# Altium project GamePi.PrjPcb
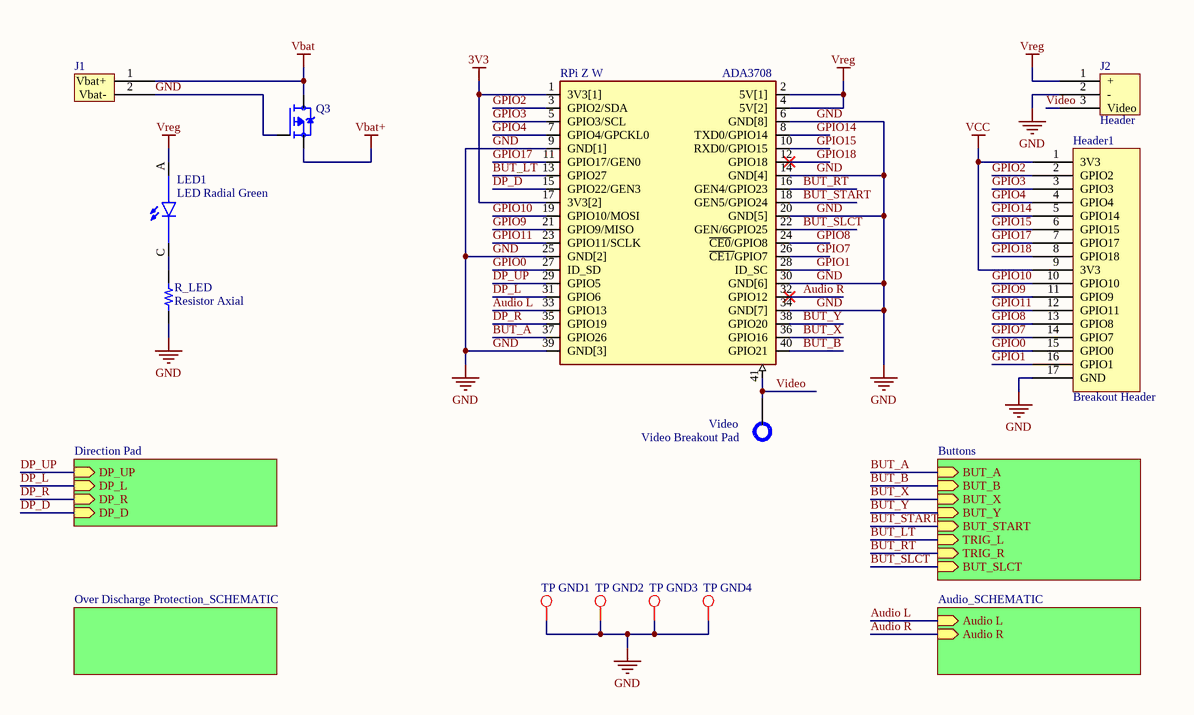
[diagram p0: GamePi_SCHEMATIC.SchDoc]
5 sheets, 92 parts. Net scope: hierarchical (ports join the sheet entries above them; power ports are global).
Board file: GamePi_PCB.PcbDoc
Sheets:
  GamePi_SCHEMATIC.SchDoc
    Direction Pad = Direction Pad_SCHEMATIC.SchDoc
    Buttons = Buttons_SCHEMATIC.SchDoc
    Over Discharge Protection_SCHEMATIC = Over Discharge Protection_SCHEMATIC.SchDoc
    Audio_SCHEMATIC = Audio_SCHEMATIC.SchDoc

## Sheet GamePi_SCHEMATIC.SchDoc
size A4; SheetNumber: 1; SheetTotal: 5

### Parts
Header1  Breakout Header  [Breakout Header]
J1  J?  [PS Header]  (value not drawn)
J2  Header  [Video Header]
LED1  LED Radial Green  [LED Radial Green]
Q3  NP15P04SLG  [NP15P04SLG]  (value not drawn)
R_LED  Resistor Axial  [Resistor Axial]
RPi_Z_W  ADA3708  [ADA3708_RPI-ZERO]
TP_GND1  Test Point  [Test Point]  (value not drawn)
TP_GND2  Test Point  [Test Point]  (value not drawn)
TP_GND3  Test Point  [Test Point]  (value not drawn)
TP_GND4  Test Point  [Test Point]  (value not drawn)
Video  Video Breakout Pad  [Video Breakout Pad]

### Sub-sheets
Audio_SCHEMATIC = Audio_SCHEMATIC.SchDoc: Audio L (in), Audio R (in)
Buttons = Buttons_SCHEMATIC.SchDoc: BUT_A (in), BUT_B (in), BUT_X (in), BUT_Y (in), BUT_START (in), TRIG_L (in), TRIG_R (in), BUT_SLCT (in)
Direction Pad = Direction Pad_SCHEMATIC.SchDoc: DP_UP (in), DP_L (in), DP_R (in), DP_D (in)
Over Discharge Protection_SCHEMATIC = Over Discharge Protection_SCHEMATIC.SchDoc: no entries

### Nets
3V3: RPi_Z_W.1(3V3[1]) RPi_Z_W.17(3V3[2])
GND: Header1.17(GND) J1.2(Vbat-) J2.2(-) Q3.1(G) R_LED.1 RPi_Z_W.6(GND[8]) RPi_Z_W.9(GND[1]) RPi_Z_W.14(GND[4]) RPi_Z_W.20(GND[5]) RPi_Z_W.25(GND[2]) RPi_Z_W.30(GND[6]) RPi_Z_W.34(GND[7]) RPi_Z_W.39(GND[3]) TP_GND1.TP?(Test_Point) TP_GND2.TP?(Test_Point) TP_GND3.TP?(Test_Point) TP_GND4.TP?(Test_Point)
Vbat: J1.1(Vbat+) Q3.4(D)
Vbat+: Q3.3(S)
VCC: Header1.1(3V3) Header1.9(3V3)
Vreg: J2.1(+) LED1.A RPi_Z_W.2(5V[1]) RPi_Z_W.4(5V[2])
Audio L: RPi_Z_W.33(GPIO13) ; sheet Audio_SCHEMATIC/Audio L
Audio R: RPi_Z_W.32(GPIO12) ; sheet Audio_SCHEMATIC/Audio R
BUT_A: RPi_Z_W.37(GPIO26) ; sheet Buttons/BUT_A
BUT_B: RPi_Z_W.40(GPIO21) ; sheet Buttons/BUT_B
BUT_LT: RPi_Z_W.13(GPIO27) ; sheet Buttons/TRIG_L
BUT_RT: RPi_Z_W.16(GEN4/GPIO23) ; sheet Buttons/TRIG_R
BUT_SLCT: RPi_Z_W.22(GEN/6GPIO25) ; sheet Buttons/BUT_SLCT
BUT_START: RPi_Z_W.18(GEN5/GPIO24) ; sheet Buttons/BUT_START
BUT_X: RPi_Z_W.36(GPIO16) ; sheet Buttons/BUT_X
BUT_Y: RPi_Z_W.38(GPIO20) ; sheet Buttons/BUT_Y
DP_D: RPi_Z_W.15(GPIO22/GEN3) ; sheet Direction Pad/DP_D
DP_L: RPi_Z_W.31(GPIO6) ; sheet Direction Pad/DP_L
DP_R: RPi_Z_W.35(GPIO19) ; sheet Direction Pad/DP_R
DP_UP: RPi_Z_W.29(GPIO5) ; sheet Direction Pad/DP_UP
GPIO0: Header1.15(GPIO0) RPi_Z_W.27(ID_SD)
GPIO1: Header1.16(GPIO1) RPi_Z_W.28(ID_SC)
GPIO2: Header1.2(GPIO2) RPi_Z_W.3(GPIO2/SDA)
GPIO3: Header1.3(GPIO3) RPi_Z_W.5(GPIO3/SCL)
GPIO4: Header1.4(GPIO4) RPi_Z_W.7(GPIO4/GPCKL0)
GPIO7: Header1.14(GPIO7) RPi_Z_W.26(~{CE1/}GPIO7)
GPIO8: Header1.13(GPIO8) RPi_Z_W.24(~{CE0}/GPIO8)
GPIO9: Header1.11(GPIO9) RPi_Z_W.21(GPIO9/MISO)
GPIO10: Header1.10(GPIO10) RPi_Z_W.19(GPIO10/MOSI)
GPIO11: Header1.12(GPIO11) RPi_Z_W.23(GPIO11/SCLK)
GPIO14: Header1.5(GPIO14) RPi_Z_W.8(TXD0/GPIO14)
GPIO15: Header1.6(GPIO15) RPi_Z_W.10(RXD0/GPIO15)
GPIO17: Header1.7(GPIO17) RPi_Z_W.11(GPIO17/GEN0)
GPIO18: Header1.8(GPIO18) RPi_Z_W.12(GPIO18)
Video: J2.3(Video) RPi_Z_W.41 Video.1
NetLED1_C: LED1.C R_LED.2

### Library data of the parts
J1 = PS Header
J2 = Video Header
RPi_Z_W = ADA3708: Raspberry Pi Zero WH (Zero W with Headers); MP: ADA3708; Availability: Unavailable; Package: None; Value: *; Price: None

## Sheet Direction Pad_SCHEMATIC.SchDoc
size A4; SheetNumber: 3; SheetTotal: 5
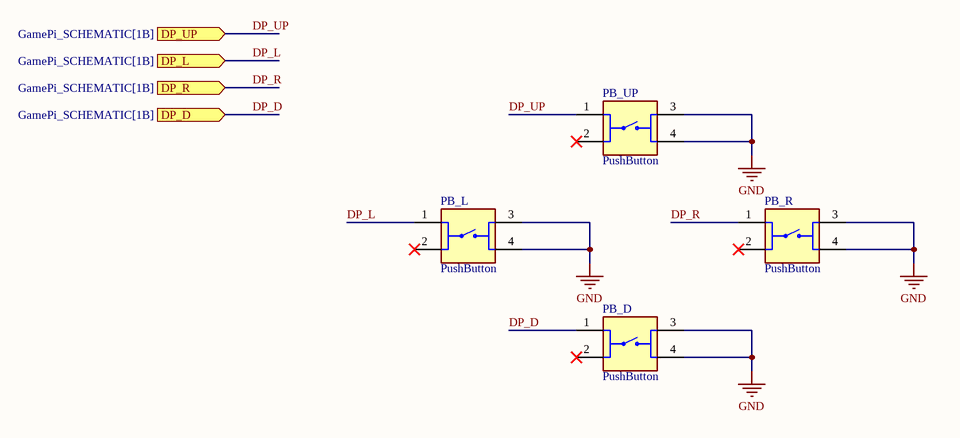
[diagram p1: Direction Pad_SCHEMATIC.SchDoc]

### Parts
PB_D  PushButton  [Push Button]
PB_L  PushButton  [Push Button]
PB_R  PushButton  [Push Button]
PB_UP  PushButton  [Push Button]

### Ports
DP_D (in, see GamePi_SCHEMATIC[1B]), DP_L (in, see GamePi_SCHEMATIC[1B]), DP_R (in, see GamePi_SCHEMATIC[1B]), DP_UP (in, see GamePi_SCHEMATIC[1B])

### Nets
GND: PB_D.3 PB_D.4 PB_L.3 PB_L.4 PB_R.3 PB_R.4 PB_UP.3 PB_UP.4
DP_D: PB_D.1 ; port DP_D
DP_L: PB_L.1 ; port DP_L
DP_R: PB_R.1 ; port DP_R
DP_UP: PB_UP.1 ; port DP_UP

Not connected (* = marked no-connect by the designer): PB_D 2*; PB_L 2*; PB_R 2*; PB_UP 2*

## Sheet Buttons_SCHEMATIC.SchDoc
size A4; SheetNumber: 4; SheetTotal: 5
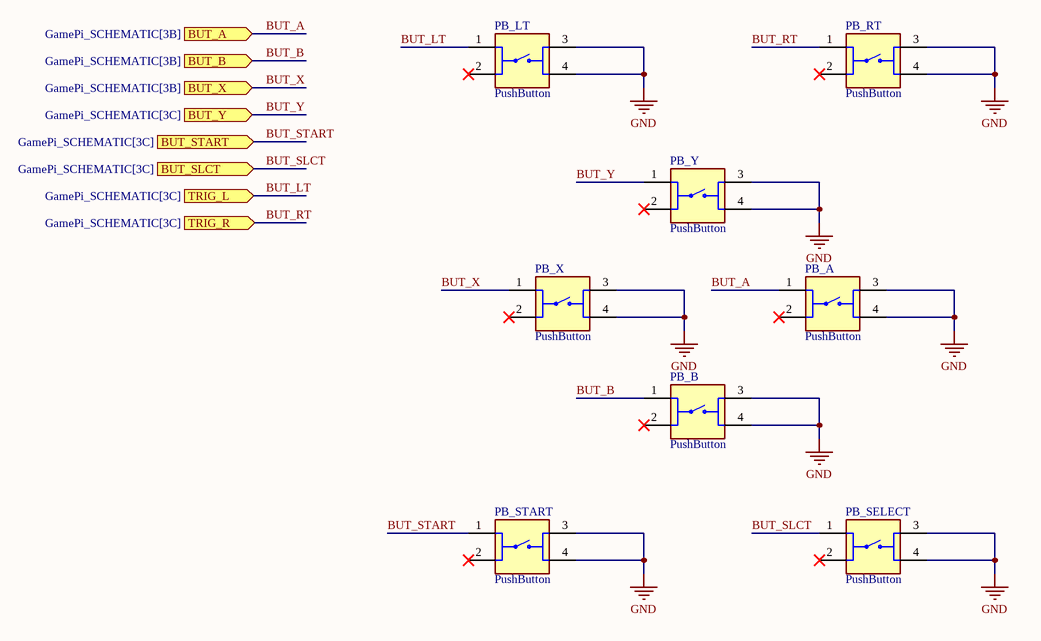
[diagram p2: Buttons_SCHEMATIC.SchDoc]

### Parts
PB_A  PushButton  [Push Button]
PB_B  PushButton  [Push Button]
PB_LT  PushButton  [Push Button]
PB_RT  PushButton  [Push Button]
PB_SELECT  PushButton  [Push Button]
PB_START  PushButton  [Push Button]
PB_X  PushButton  [Push Button]
PB_Y  PushButton  [Push Button]

### Ports
BUT_A (in, see GamePi_SCHEMATIC[3B]), BUT_B (in, see GamePi_SCHEMATIC[3B]), BUT_SLCT (in, see GamePi_SCHEMATIC[3C]), BUT_START (in, see GamePi_SCHEMATIC[3C]), BUT_X (in, see GamePi_SCHEMATIC[3B]), BUT_Y (in, see GamePi_SCHEMATIC[3C]), TRIG_L (in, see GamePi_SCHEMATIC[3C]), TRIG_R (in, see GamePi_SCHEMATIC[3C])

### Nets
GND: PB_A.3 PB_A.4 PB_B.3 PB_B.4 PB_LT.3 PB_LT.4 PB_RT.3 PB_RT.4 PB_SELECT.3 PB_SELECT.4 PB_START.3 PB_START.4 PB_X.3 PB_X.4 PB_Y.3 PB_Y.4
BUT_A: PB_A.1 ; port BUT_A
BUT_B: PB_B.1 ; port BUT_B
BUT_LT: PB_LT.1 ; port TRIG_L
BUT_RT: PB_RT.1 ; port TRIG_R
BUT_SLCT: PB_SELECT.1 ; port BUT_SLCT
BUT_START: PB_START.1 ; port BUT_START
BUT_X: PB_X.1 ; port BUT_X
BUT_Y: PB_Y.1 ; port BUT_Y

Not connected (* = marked no-connect by the designer): PB_A 2*; PB_B 2*; PB_LT 2*; PB_RT 2*; PB_SELECT 2*; PB_START 2*; PB_X 2*; PB_Y 2*

## Sheet Over Discharge Protection_SCHEMATIC.SchDoc
size A4; SheetNumber: 2; SheetTotal: 5
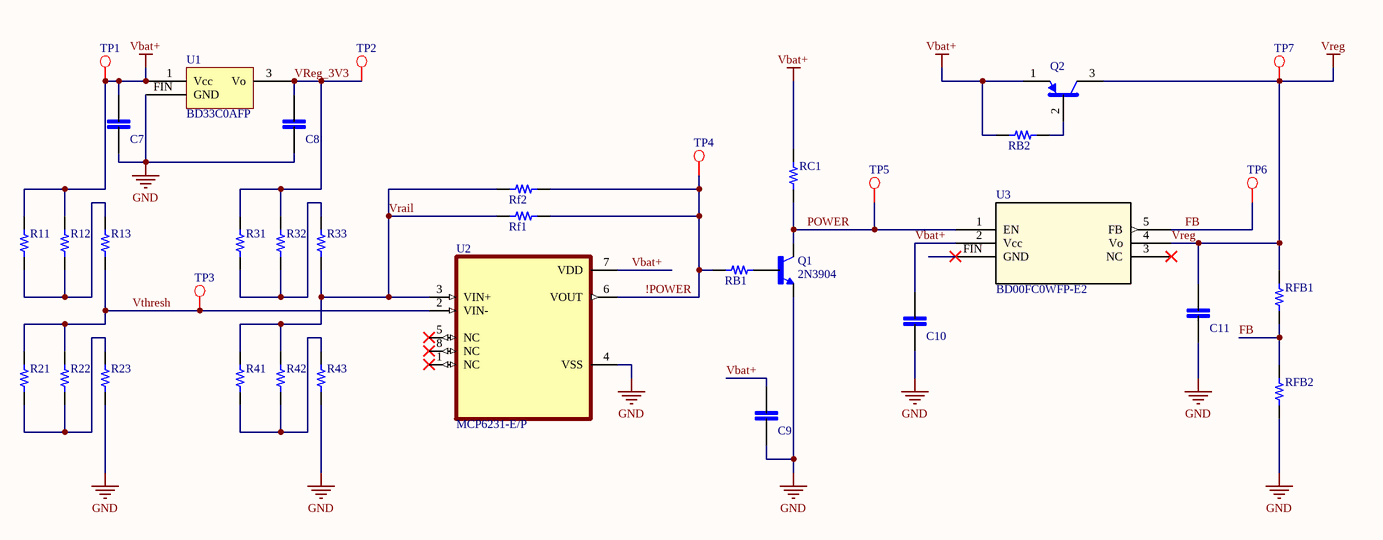
[diagram p3: Over Discharge Protection_SCHEMATIC.SchDoc]

### Parts
C7  0805  [Capacitor 0805]  (value not drawn)
C8  0805  [Capacitor 0805]  (value not drawn)
C9  0805  [Capacitor 0805]  (value not drawn)
C10  0805  [Capacitor 0805]  (value not drawn)
C11  0805  [Capacitor 0805]  (value not drawn)
Q1  2N3904  [2N3904]
Q2  2N3906  [2N3904]  (value not drawn)
R11  Resistor Axial  [Resistor Axial]  (value not drawn)
R12  Resistor Axial  [Resistor Axial]  (value not drawn)
R13  Resistor Axial  [Resistor Axial]  (value not drawn)
R21  Resistor Axial  [Resistor Axial]  (value not drawn)
R22  Resistor Axial  [Resistor Axial]  (value not drawn)
R23  Resistor Axial  [Resistor Axial]  (value not drawn)
R31  Resistor Axial  [Resistor Axial]  (value not drawn)
R32  Resistor Axial  [Resistor Axial]  (value not drawn)
R33  Resistor Axial  [Resistor Axial]  (value not drawn)
R41  Resistor Axial  [Resistor Axial]  (value not drawn)
R42  Resistor Axial  [Resistor Axial]  (value not drawn)
R43  Resistor Axial  [Resistor Axial]  (value not drawn)
RB1  Resistor Axial  [Resistor Axial]  (value not drawn)
RB2  Resistor Axial  [Resistor Axial]  (value not drawn)
RC1  Resistor Axial  [Resistor Axial]  (value not drawn)
Rf1  Resistor Axial  [Resistor Axial]  (value not drawn)
Rf2  Resistor Axial  [Resistor Axial]  (value not drawn)
RFB1  Resistor Axial  [Resistor Axial]  (value not drawn)
RFB2  Resistor Axial  [Resistor Axial]  (value not drawn)
TP1  Test Point  [Test Point]  (value not drawn)
TP2  Test Point  [Test Point]  (value not drawn)
TP3  Test Point  [Test Point]  (value not drawn)
TP4  Test Point  [Test Point]  (value not drawn)
TP5  Test Point  [Test Point]  (value not drawn)
TP6  Test Point  [Test Point]  (value not drawn)
TP7  Test Point  [Test Point]  (value not drawn)
U1  BD33C0AFP  [BD33C0AFP]
U2  MCP6231-E/P  [MCP6231-E/P]
U3  BD00FC0WFP-E2  [BD00FC0WFP-E2]

### Nets
GND: C7.1 C8.1 C9.1 C10.1 C11.1 Q1.1(E) R23.1 R43.1 RFB2.1 U1.FIN(GND) U2.4(VSS)
Vbat+: C7.2 C9.2 C10.2 Q2.1(E) R11.2 R12.2 RB2.2 RC1.2 TP1.TP?(Test_Point) U1.1(Vcc) U2.7(VDD) U3.2(Vcc)
Vreg: C11.2 Q2.3(C) RFB1.2 TP7.TP?(Test_Point) U3.4(Vo)
!POWER: RB1.2 Rf1.1 Rf2.1 TP4.TP?(Test_Point) U2.6(VOUT)
FB: RFB1.1 RFB2.2 TP6.TP?(Test_Point) U3.5(FB)
POWER: Q1.3(C) RC1.1 TP5.TP?(Test_Point) U3.1(EN)
Vrail: R33.1 R41.2 R42.2 Rf1.2 Rf2.2 U2.3(VIN+)
VReg_3V3: C8.2 R31.2 R32.2 TP2.TP?(Test_Point) U1.3(Vo)
Vthresh: R13.1 R21.2 R22.2 TP3.TP?(Test_Point) U2.2(VIN-)
NetQ1_2: Q1.2(B) RB1.1
NetQ2_2: Q2.2(B) RB2.1
NetR11_1: R11.1 R12.1 R13.2
NetR21_1: R21.1 R22.1 R23.2
NetR31_1: R31.1 R32.1 R33.2
NetR41_1: R41.1 R42.1 R43.2

Not connected (* = marked no-connect by the designer): U2 1(NC)* 5(NC)* 8(NC)*; U3 3(NC)* FIN(GND)*

### Library data of the parts
C7-C11 = Capacitor 0805

## Sheet Audio_SCHEMATIC.SchDoc
size A4; SheetNumber: 5; SheetTotal: 5
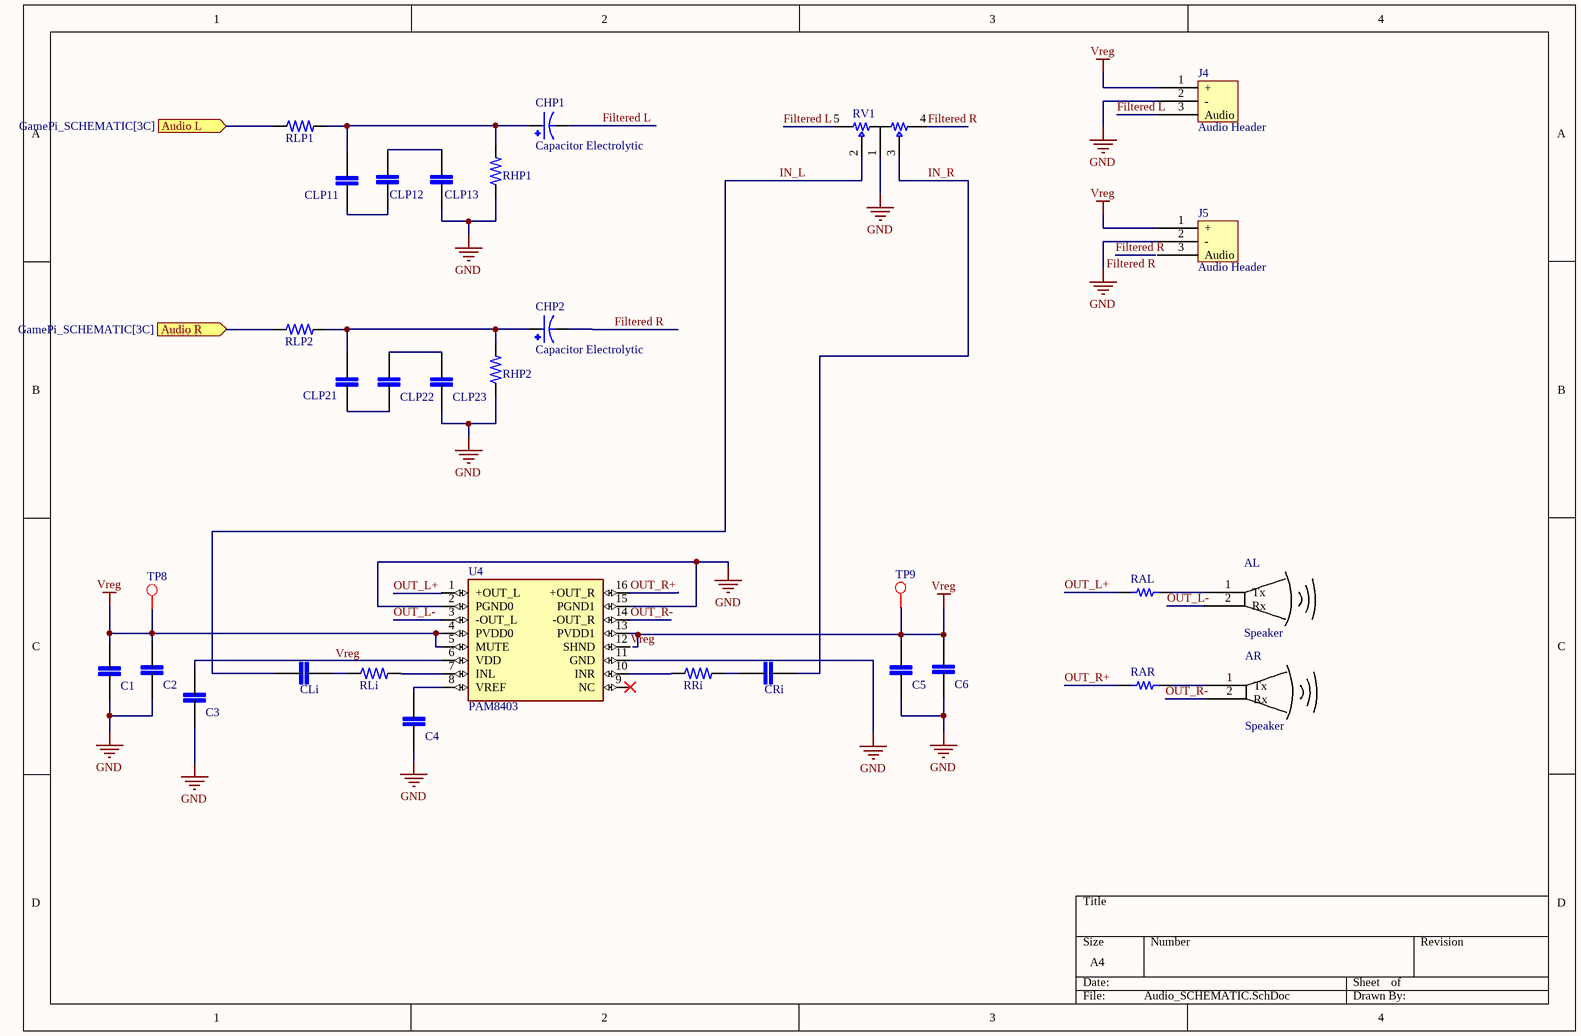
[diagram p4: Audio_SCHEMATIC.SchDoc]

### Parts
AL  Speaker  [Speaker]
AR  Speaker  [Speaker]
C1  0805  [Capacitor 0805]  (value not drawn)
C2  0805  [Capacitor 0805]  (value not drawn)
C3  0805  [Capacitor 0805]  (value not drawn)
C4  0805  [Capacitor 0805]  (value not drawn)
C5  0805  [Capacitor 0805]  (value not drawn)
C6  0805  [Capacitor 0805]  (value not drawn)
CHP1  Capacitor Electrolytic  [Capacitor Electrolytic]
CHP2  Capacitor Electrolytic  [Capacitor Electrolytic]
CLi  0805  [Capacitor 0805]  (value not drawn)
CLP11  0805  [Capacitor 0805]  (value not drawn)
CLP12  0805  [Capacitor 0805]  (value not drawn)
CLP13  0805  [Capacitor 0805]  (value not drawn)
CLP21  0805  [Capacitor 0805]  (value not drawn)
CLP22  0805  [Capacitor 0805]  (value not drawn)
CLP23  0805  [Capacitor 0805]  (value not drawn)
CRi  0805  [Capacitor 0805]  (value not drawn)
J4  Audio Header  [Audio Header]
J5  Audio Header  [Audio Header]
RAL  Resistor Axial  [Resistor Axial]  (value not drawn)
RAR  Resistor Axial  [Resistor Axial]  (value not drawn)
RHP1  0805  [Resistor 0805]  (value not drawn)
RHP2  0805  [Resistor 0805]  (value not drawn)
RLi  0805  [Resistor 0805]  (value not drawn)
RLP1  0805  [Resistor 0805]  (value not drawn)
RLP2  0805  [Resistor 0805]  (value not drawn)
RRi  0805  [Resistor 0805]  (value not drawn)
RV1  B103 Potentiometer Wheel  [B103 Pot Wheel]  (value not drawn)
TP8  Test Point  [Test Point]  (value not drawn)
TP9  Test Point  [Test Point]  (value not drawn)
U4  PAM8403  [PAM8403]

### Ports
Audio L (in, see GamePi_SCHEMATIC[3C]), Audio R (in, see GamePi_SCHEMATIC[3C])

### Nets
GND: C1.1 C2.1 C3.1 C4.1 C5.1 C6.1 CLP13.1 CLP23.1 J4.2(-) J5.2(-) RHP1.1 RHP2.1 RV1.1 U4.2(PGND0) U4.11(GND) U4.15(PGND1)
Vreg: C1.2 C2.2 C5.2 C6.2 J4.1(+) J5.1(+) TP8.TP?(Test_Point) TP9.TP?(Test_Point) U4.4(PVDD0) U4.5(MUTE) U4.12(SHND) U4.13(PVDD1)
Audio L: RLP1.1 ; port Audio L
Audio R: RLP2.1 ; port Audio R
Filtered L: CHP1.N J4.3(Audio) RV1.5
Filtered R: CHP2.N J5.3(Audio) RV1.4
IN_L: CLi.1 RV1.2
IN_R: CRi.2 RV1.3
OUT_L+: RAL.1 U4.1(+OUT_L)
OUT_L-: AL.2(Rx) U4.3(-OUT_L)
OUT_R+: RAR.1 U4.16(+OUT_R)
OUT_R-: AR.2(Rx) U4.14(-OUT_R)
NetAL_1: AL.1(Tx) RAL.2
NetAR_1: AR.1(Tx) RAR.2
NetC3_2: C3.2 U4.6(VDD)
NetC4_2: C4.2 U4.8(VREF)
NetCHP1_P: CHP1.P CLP11.2 RHP1.2 RLP1.2
NetCHP2_P: CHP2.P CLP21.2 RHP2.2 RLP2.2
NetCLi_2: CLi.2 RLi.1
NetCLP11_1: CLP11.1 CLP12.1
NetCLP12_2: CLP12.2 CLP13.2
NetCLP21_1: CLP21.1 CLP22.1
NetCLP22_2: CLP22.2 CLP23.2
NetCRi_1: CRi.1 RRi.2
NetRLi_2: RLi.2 U4.7(INL)
NetRRi_1: RRi.1 U4.10(INR)

Not connected (* = marked no-connect by the designer): U4 9(NC)*

### Notes on the sheet
- Labels drawn without touching a wire or pin: Vreg

### Library data of the parts
C1-C6 CLi CLP11-CLP13 CLP21-CLP23 CRi = Capacitor 0805
RHP1 RHP2 RLi RLP1 RLP2 RRi = Resistor 0805

## Nets that join several sheets
GND: GamePi_SCHEMATIC (17 pins), Direction Pad_SCHEMATIC (8 pins), Buttons_SCHEMATIC (16 pins), Over Discharge Protection_SCHEMATIC (11 pins), Audio_SCHEMATIC (16 pins)
Vbat+: GamePi_SCHEMATIC (Q3.3), Over Discharge Protection_SCHEMATIC (12 pins)
Vreg: GamePi_SCHEMATIC (J2.1 LED1.A RPi_Z_W.2 RPi_Z_W.4), Over Discharge Protection_SCHEMATIC (5 pins), Audio_SCHEMATIC (12 pins)
Audio L: GamePi_SCHEMATIC (RPi_Z_W.33), Audio_SCHEMATIC (RLP1.1)
Audio R: GamePi_SCHEMATIC (RPi_Z_W.32), Audio_SCHEMATIC (RLP2.1)
BUT_A: GamePi_SCHEMATIC (RPi_Z_W.37), Buttons_SCHEMATIC (PB_A.1)
BUT_B: GamePi_SCHEMATIC (RPi_Z_W.40), Buttons_SCHEMATIC (PB_B.1)
BUT_LT: GamePi_SCHEMATIC (RPi_Z_W.13), Buttons_SCHEMATIC (PB_LT.1)
BUT_RT: GamePi_SCHEMATIC (RPi_Z_W.16), Buttons_SCHEMATIC (PB_RT.1)
BUT_SLCT: GamePi_SCHEMATIC (RPi_Z_W.22), Buttons_SCHEMATIC (PB_SELECT.1)
BUT_START: GamePi_SCHEMATIC (RPi_Z_W.18), Buttons_SCHEMATIC (PB_START.1)
BUT_X: GamePi_SCHEMATIC (RPi_Z_W.36), Buttons_SCHEMATIC (PB_X.1)
BUT_Y: GamePi_SCHEMATIC (RPi_Z_W.38), Buttons_SCHEMATIC (PB_Y.1)
DP_D: GamePi_SCHEMATIC (RPi_Z_W.15), Direction Pad_SCHEMATIC (PB_D.1)
DP_L: GamePi_SCHEMATIC (RPi_Z_W.31), Direction Pad_SCHEMATIC (PB_L.1)
DP_R: GamePi_SCHEMATIC (RPi_Z_W.35), Direction Pad_SCHEMATIC (PB_R.1)
DP_UP: GamePi_SCHEMATIC (RPi_Z_W.29), Direction Pad_SCHEMATIC (PB_UP.1)